# Altium schematic sheet power-mcu.SchDoc: Power 3V
size Letter; CheckedBy: J. Brinton; CompanyName: Signal Laboratories, Inc.; DrawnBy: J. Brinton; Engineer: J. Brinton; Address1: 3479 Edison Way; Address2: Menlo Park CA 94025; Address3: +1 (877) 778-8435; Address4: siglabs.com; Revision: 3; SheetNumber: 41; SheetTotal: 49
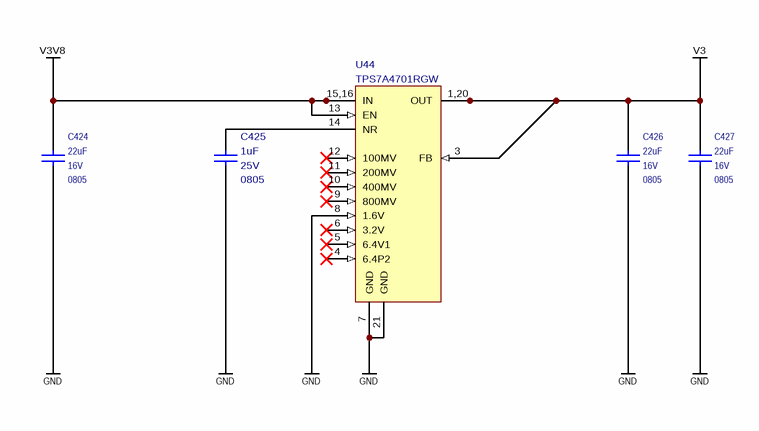
[diagram p0: power-mcu.SchDoc]

## Parts
C424  value 22uF  Voltage: 16V  Package: 0805  [CAPC200X125X145L45N]  (hidden comment: CL21A226KOQNNNE)
C425  value 1uF  Package: 0805  Voltage: 25V  [CAPC200X125X145L45N]  (hidden comment: TMK212B7105KG)
C426  value 22uF  Voltage: 16V  Package: 0805  [CAPC200X125X145L45N]  (hidden comment: CL21A226KOQNNNE)
C427  value 22uF  Voltage: 16V  Package: 0805  [CAPC200X125X145L45N]  (hidden comment: CL21A226KOQNNNE)
U44  TPS7A4701RGW  [QFN65P500X500X100-21N]

## Nets
GND: C424.1 C425.2 C426.1 C427.1 U44.7(GND) U44.8(1.6V) U44.21(GND)
V3: C426.2 C427.2 U44.1(OUT) U44.3(FB) U44.20(OUT)
V3V8: C424.2 U44.13(EN) U44.15(IN) U44.16(IN)
NetC425_1: C425.1 U44.14(NR)

Not connected (* = marked no-connect by the designer): U44 4(6.4P2)* 5(6.4V1)* 6(3.2V)* 9(800MV)* 10(400MV)* 11(200MV)* 12(100MV)*

## Notes on the sheet
- Title
- Engineer
- Revision
- Drawn By
- Checked By
- Date
- Sheet
- of
- (in symbol TPS7A4701RGW_1) 15,16; 1,20

## Library data of the parts
C424 C426 C427 = CAP 0603: Ceramic Capacitor 22uF ±10% 16V X5R 0805; Manufacturer: Samsung; Tr: -55:85; Manufacturer P/N: CL21A226KOQNNNE; Tolerance: ±10%
C425 = TMK212B7105KG: Ceramic Capacitor 1uF ±10% 25V X7R 0805; Manufacturer: Taiyo Yuden; Manufacturer P/N: TMK212B7105KG; Tolerance: ±10%; Tr: *
U44 = TPS7A4701RGW_1: Low-Dropout Linear Regulator 20-VQFN; Manufacturer: Texas Instruments; Manufacturer P/N: TPS7A4701RGW; Package: VQFN-20